# EAGLE design MKRFoxShield_v2 (EAGLE 8.4.3)
Assembly variants: Chip Antenna, Antenna Connector

## Sheet 1 of 2
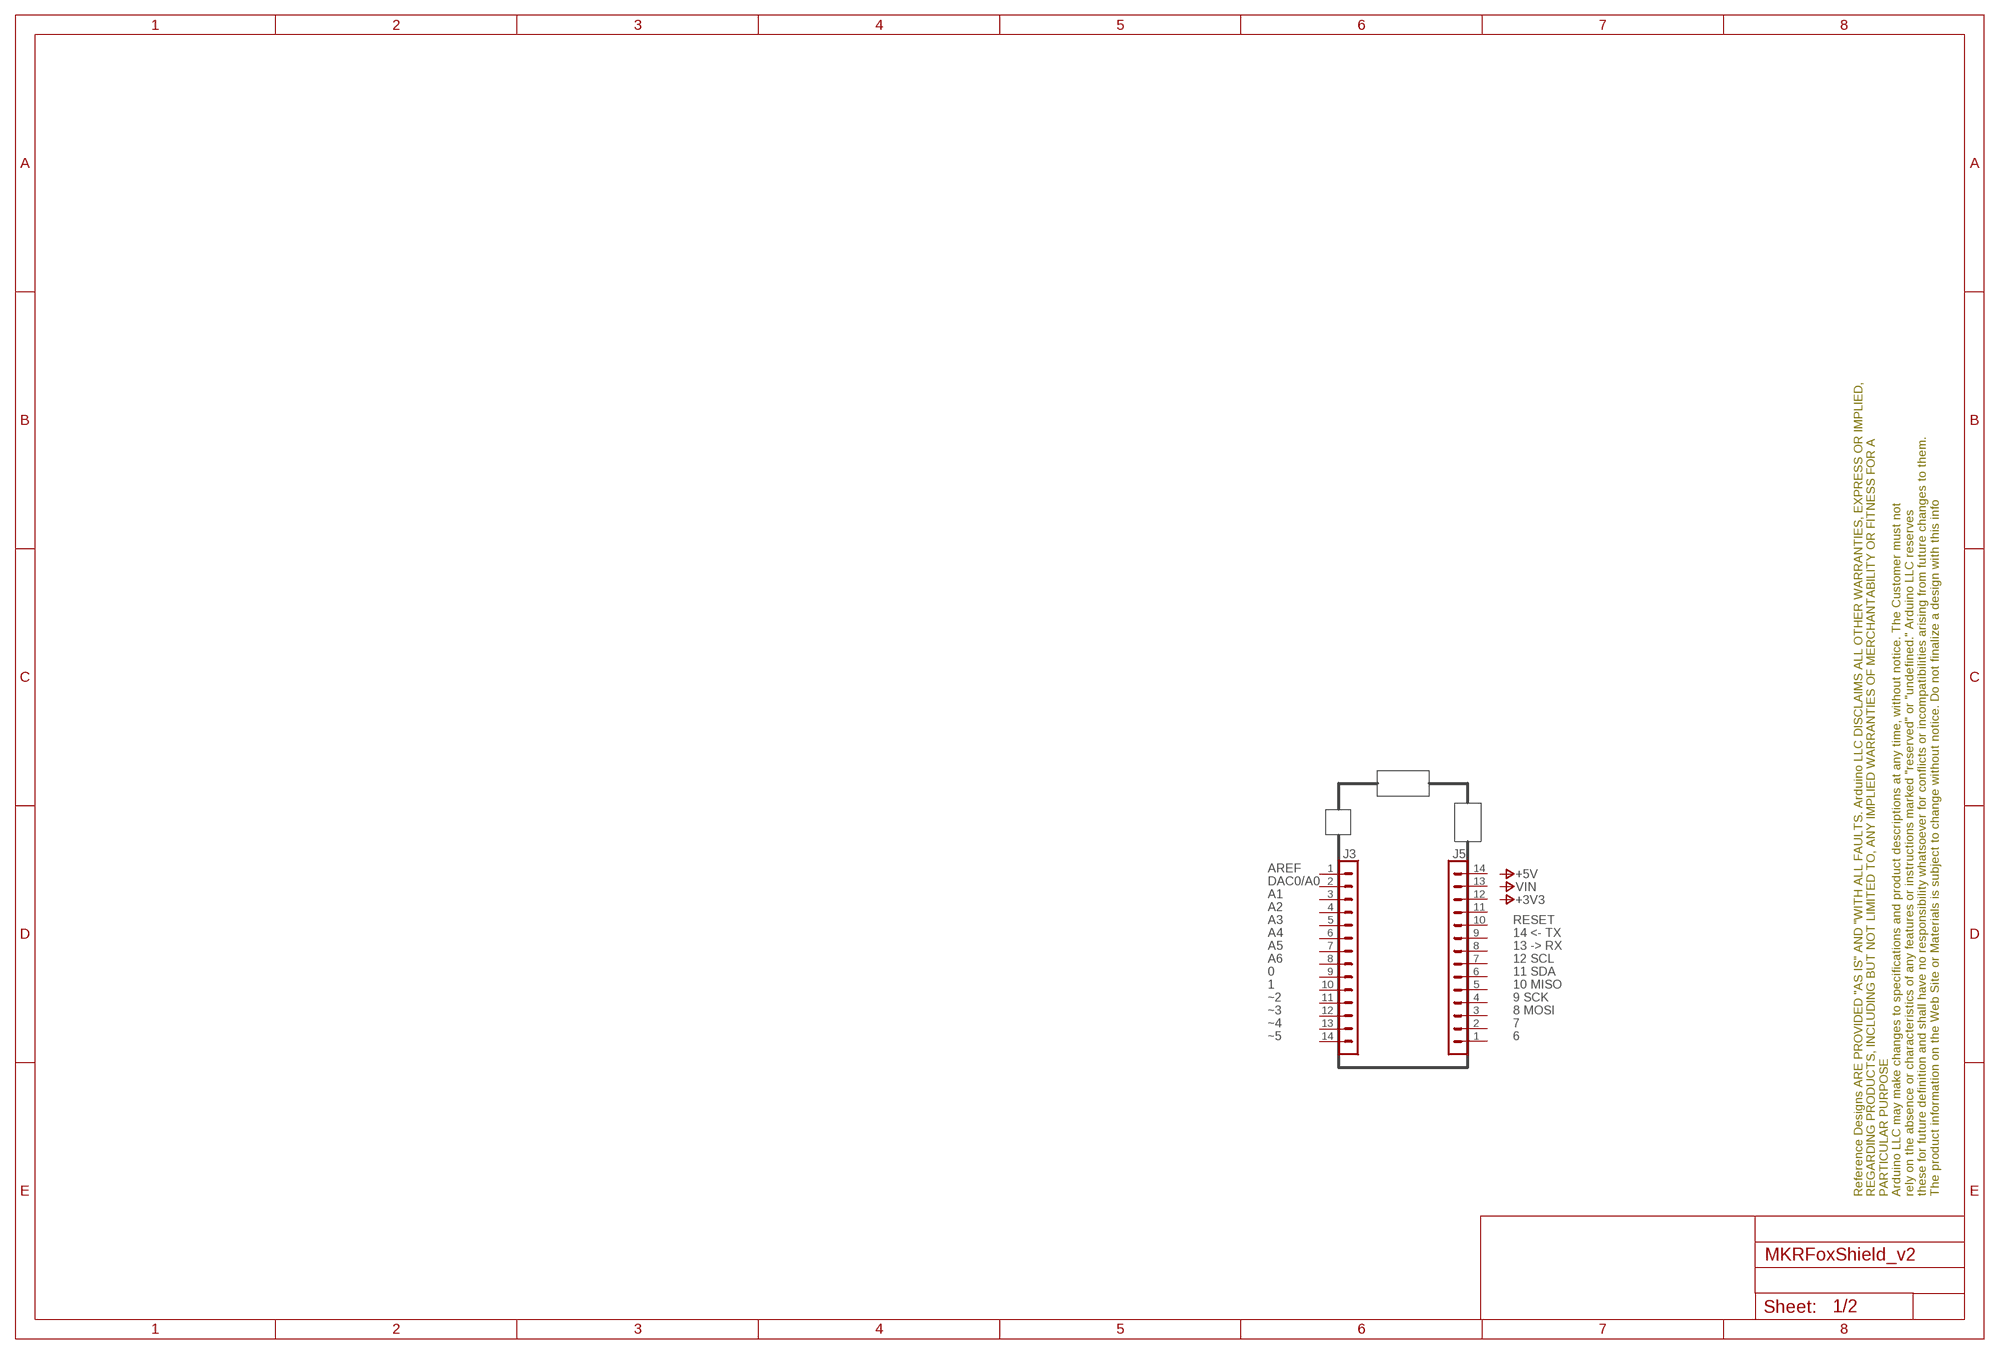
[diagram p0: schematic, sheet 1]

### Parts
FRAME1  Page 1  A3L-LOC  [FRAME]
J3  DNP  PINHD-1X14-SMTH-SMD  [1X14_SMD_TH]
J5  DNP  PINHD-1X14-SMTH-SMD  [1X14_SMD_TH]
Unconnected: J3.1 J3.2 J3.3 J3.4 J3.5 J3.6 J3.7 J3.8 J3.9 J3.10 J3.11 J3.12 J3.13 J3.14 J5.1 J5.2 J5.3 J5.4 J5.5 J5.6 J5.7 J5.8 J5.9 J5.10 J5.11 J5.12 J5.13 J5.14

### Notes on the sheet
- AREF
- DAC0/A0
- A1
- A2
- A3 | RESET
- A4 | 14 <- TX
- A5 | 13 -> RX
- A6 | 12 SCL
- 0 | 11 SDA
- 1 | 10 MISO
- ~2 | 9 SCK
- ~3 | 8 MOSI
- ~4 | 7
- ~5 | 6

## Sheet 2 of 2
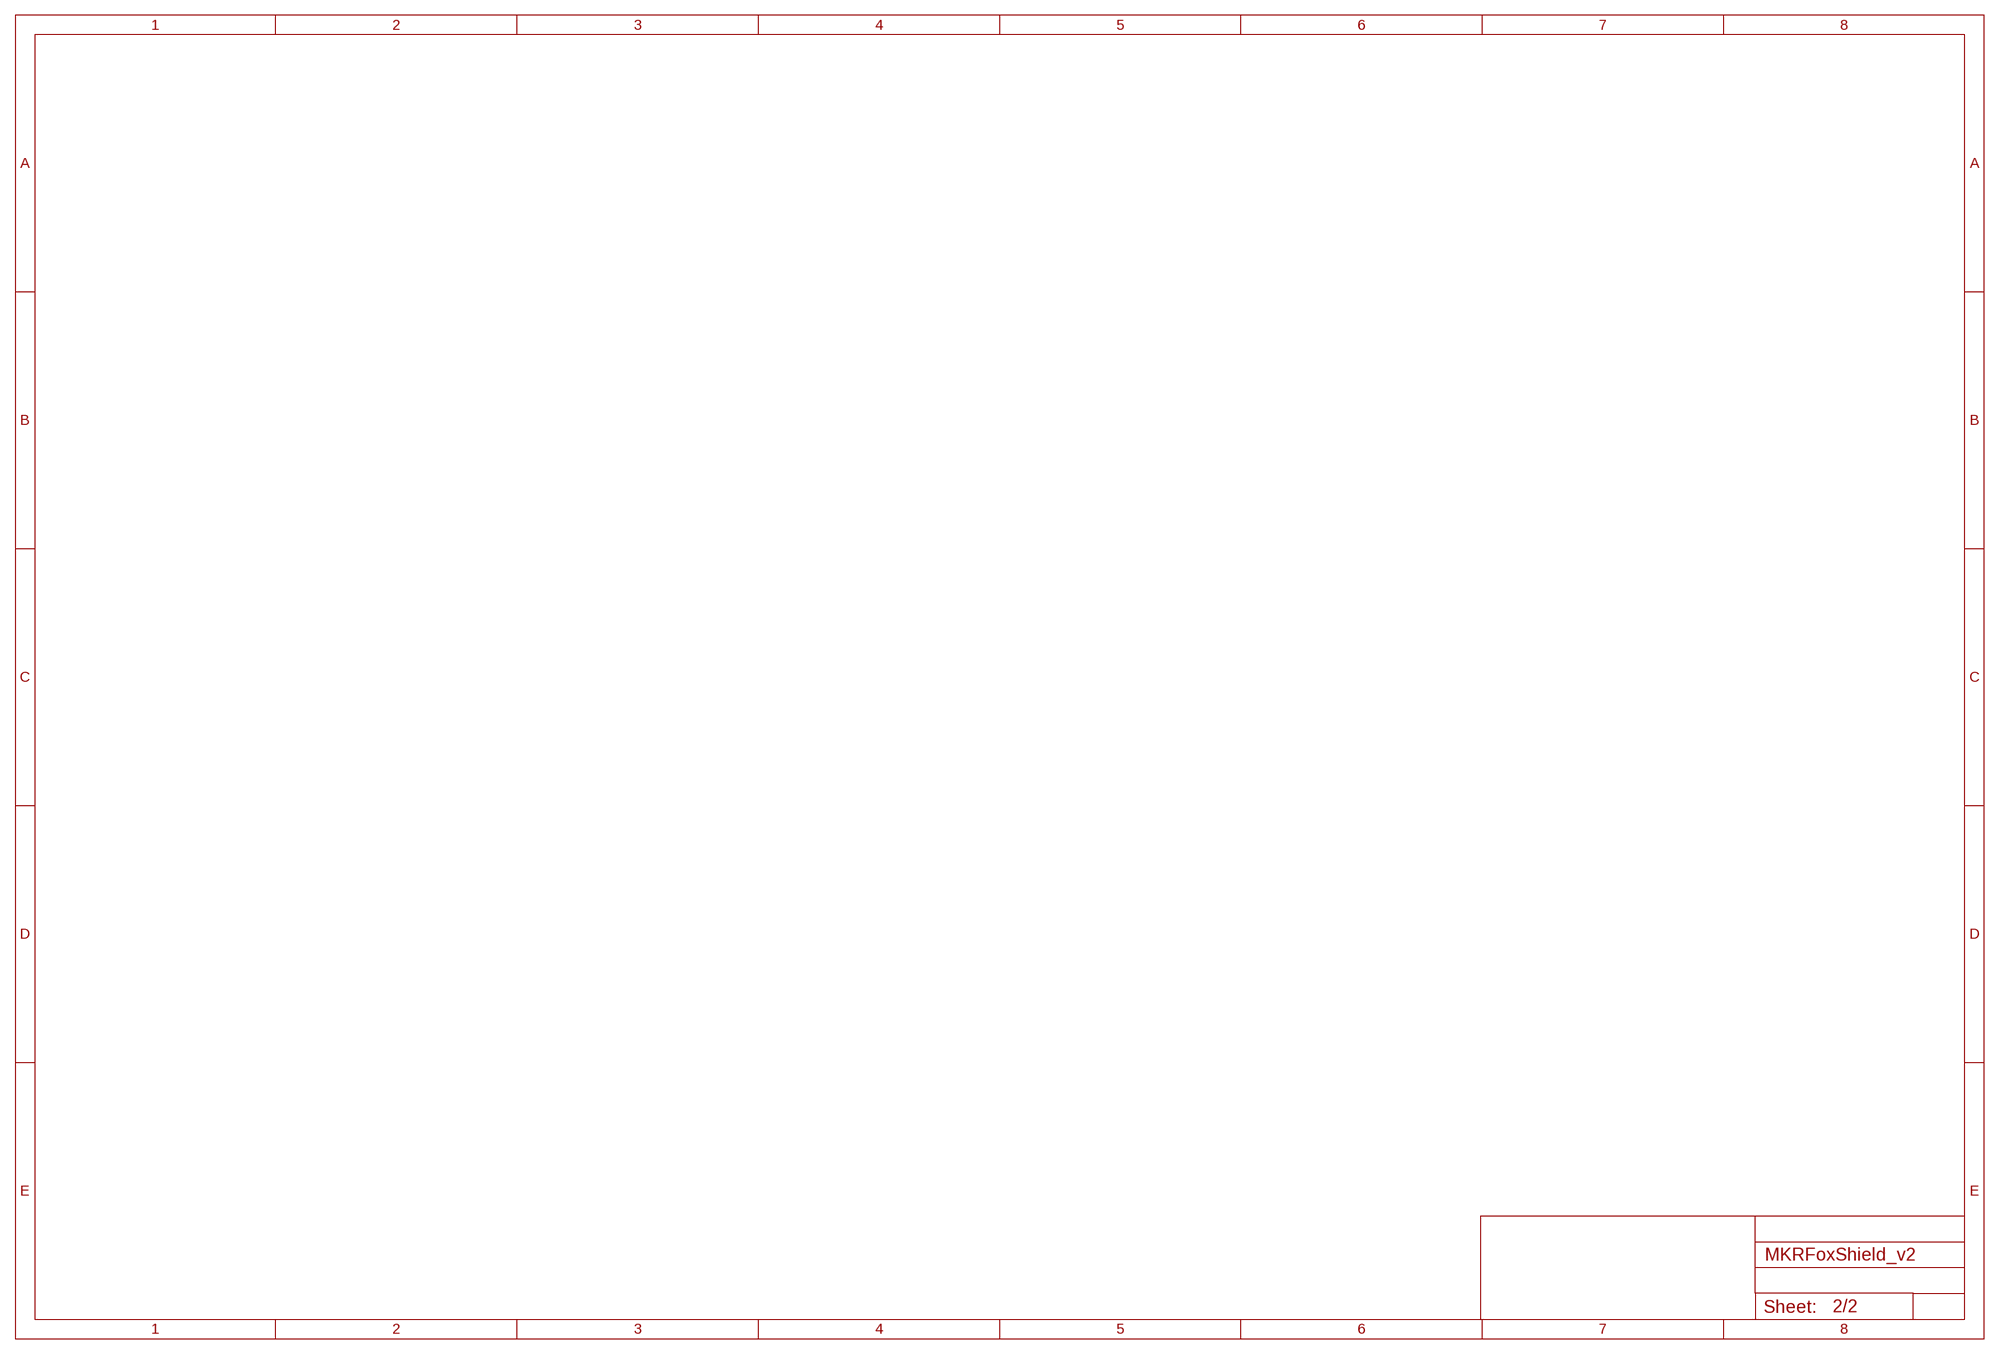
[diagram p1: schematic, sheet 2]

## Library data of the parts
FRAME1 = Arduino-utility:A3L-LOC: FRAME DIN A3, landscape with location and doc. field
J3 J5 = Arduino-connectors:PINHD-1X14-SM: PIN HEADER; DATASHEET: -; DISTRIBUTOR-LINK: -; DISTRIBUTOR-PN: -; MANUFACTURER: ELDECO; MANUFACTURER-PN: FH254114DF08500T

## Net classes
0 default: width 0.25 mm, drill 0.195 mm

## Board
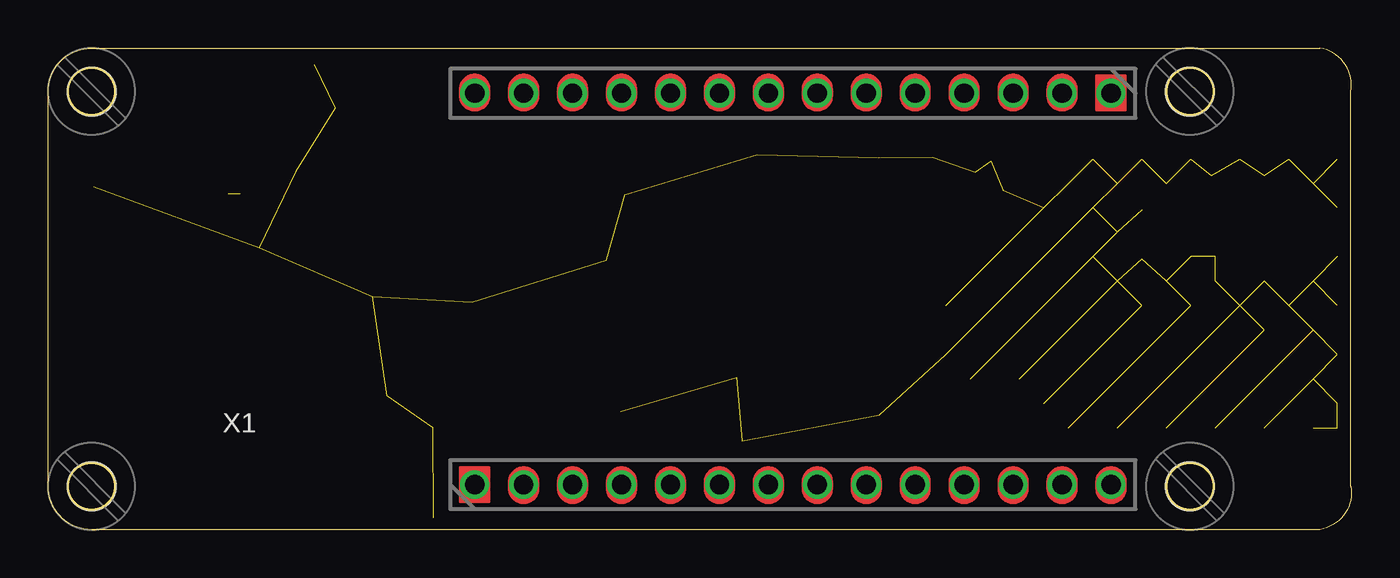
[diagram p2: board, top side]
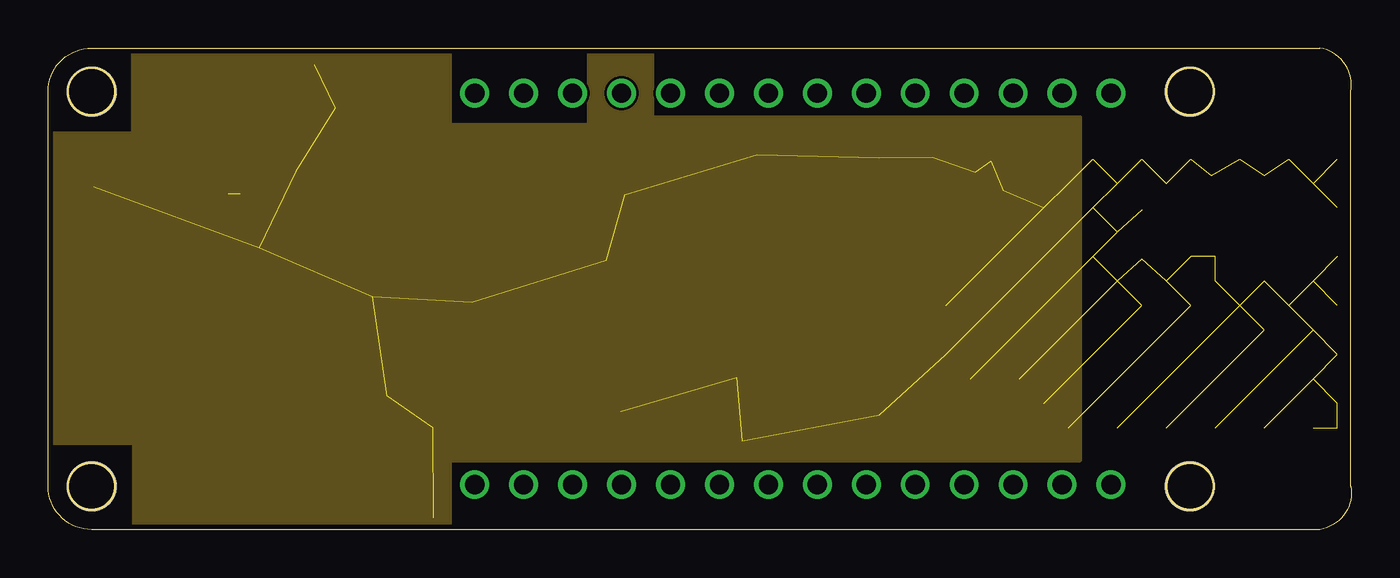
[diagram p3: board, inner layer LFSignals]
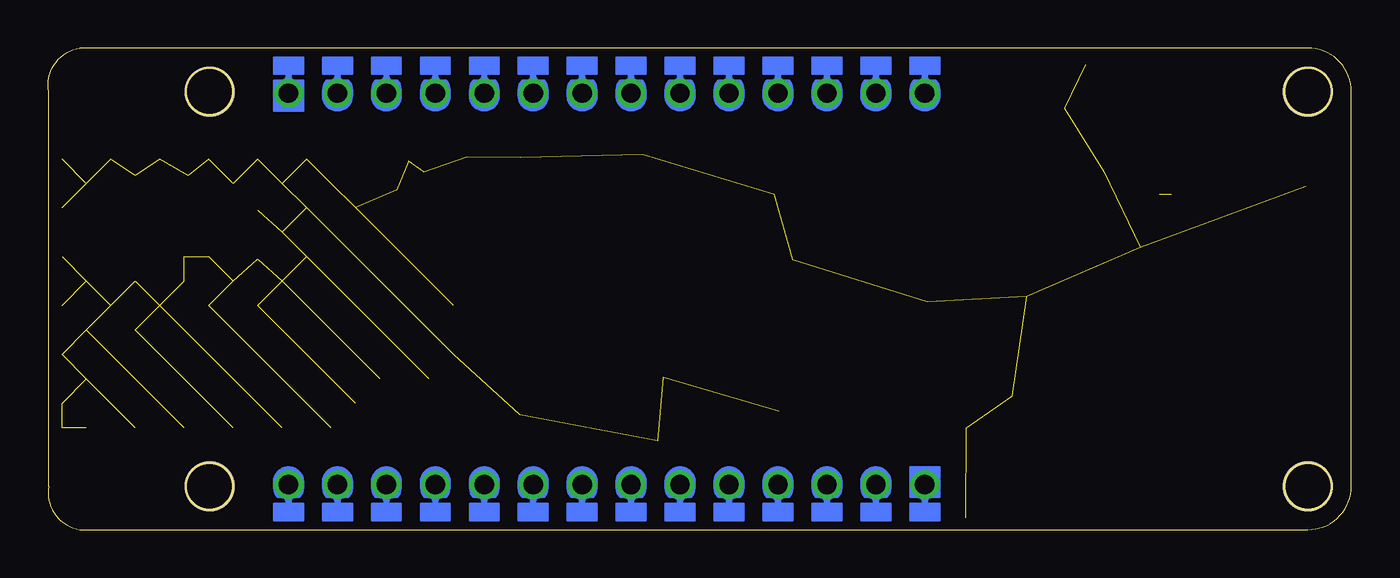
[diagram p4: board, bottom side, seen from below]

Size 67.63 x 25 mm. Coordinates in mm from the lower left corner, seen from the top.
Outline: 66,0 2.25,0 arc-90 0,2.25 0,22.75 arc-90 2.25,25 66,25 arc-90 67.6,22.75 67.6,2.25 arc-90 66,0
Copper layers (1*2*15*16): Top 0.035mm / dielectric 0.2mm / LFSignals 0.0175mm / dielectric 0.3mm / POWER 0.0175mm / dielectric 0.2mm / Bottom 0.035mm
Design rules "B&B_4layers *": minimum track width 8mil, minimum drill 0.195mm, track to track 5mil, track to pad 5mil, pad to pad 5mil, via to via 5mil, smd to smd 0mil, copper to edge 10mil, drill to drill 8mil, minimum pad ring 6mil, minimum via ring 4mil, stop-mask expansion 4mil, vias tented up to drill 25mil, thermal gap 7mil
Holes 2.5 mm at 2.25,2.25 2.25,22.75 59.25,22.75 59.25,2.25
tRestrict: area 0,0 to 4.5,4.5; area 0,20.5 to 4.5,25; 18 lines
bRestrict: area 0,0 to 4.5,4.5; area 0,20.5 to 4.5,25; 18 lines

### Footprints (pad centres in the part's own frame; a part is rotated, then mirrored left to right if it is on the bottom)
1X14_SMD_TH = drill 1: 1 0,0; 2 2.54,0; 3 5.08,0; 4 7.62,0; 5 10.16,0; 6 12.7,0; 7 15.24,0; 8 17.78,0; 9 20.32,0; 10 22.86,0; 11 25.4,0; 12 27.94,0; 13 30.48,0; 14 33.02,0

### Placement (x,y rotation side)
FRAME1  -27.2,3.38 0 top  (outside the outline)
J3  22.13,2.34 0 top
J5  55.15,22.66 180 top
U$5  [MH_RND_F_2.2MM_NM]  2.25,2.25 90 top
U$6  [MH_RND_F_2.2MM_NM]  2.25,22.75 90 top
U$7  [MH_RND_F_2.2MM_NM]  59.25,22.75 90 top
U$8  [MH_RND_F_2.2MM_NM]  59.25,2.25 90 top

### Tracks (layer width: path | path; a pad name or v marks a point on that pad's centre or on a via)
+5V  (1 unrouted)
GND  (103 unrouted)
  pour LFSignals: 0,4.5 0,20.55 4.45,20.55 4.45,25 20.8,25 20.8,21 28.1,21 28.1,25 31.3,25 31.3,21.4 53.52,21.4 53.52,5 53.52,3.6 20.8,3.6 20.8,0 4.5,0 4.5,4.5

### Text on the board
tNames: X1